# Altium schematic sheet MCU.SchDoc
size A4
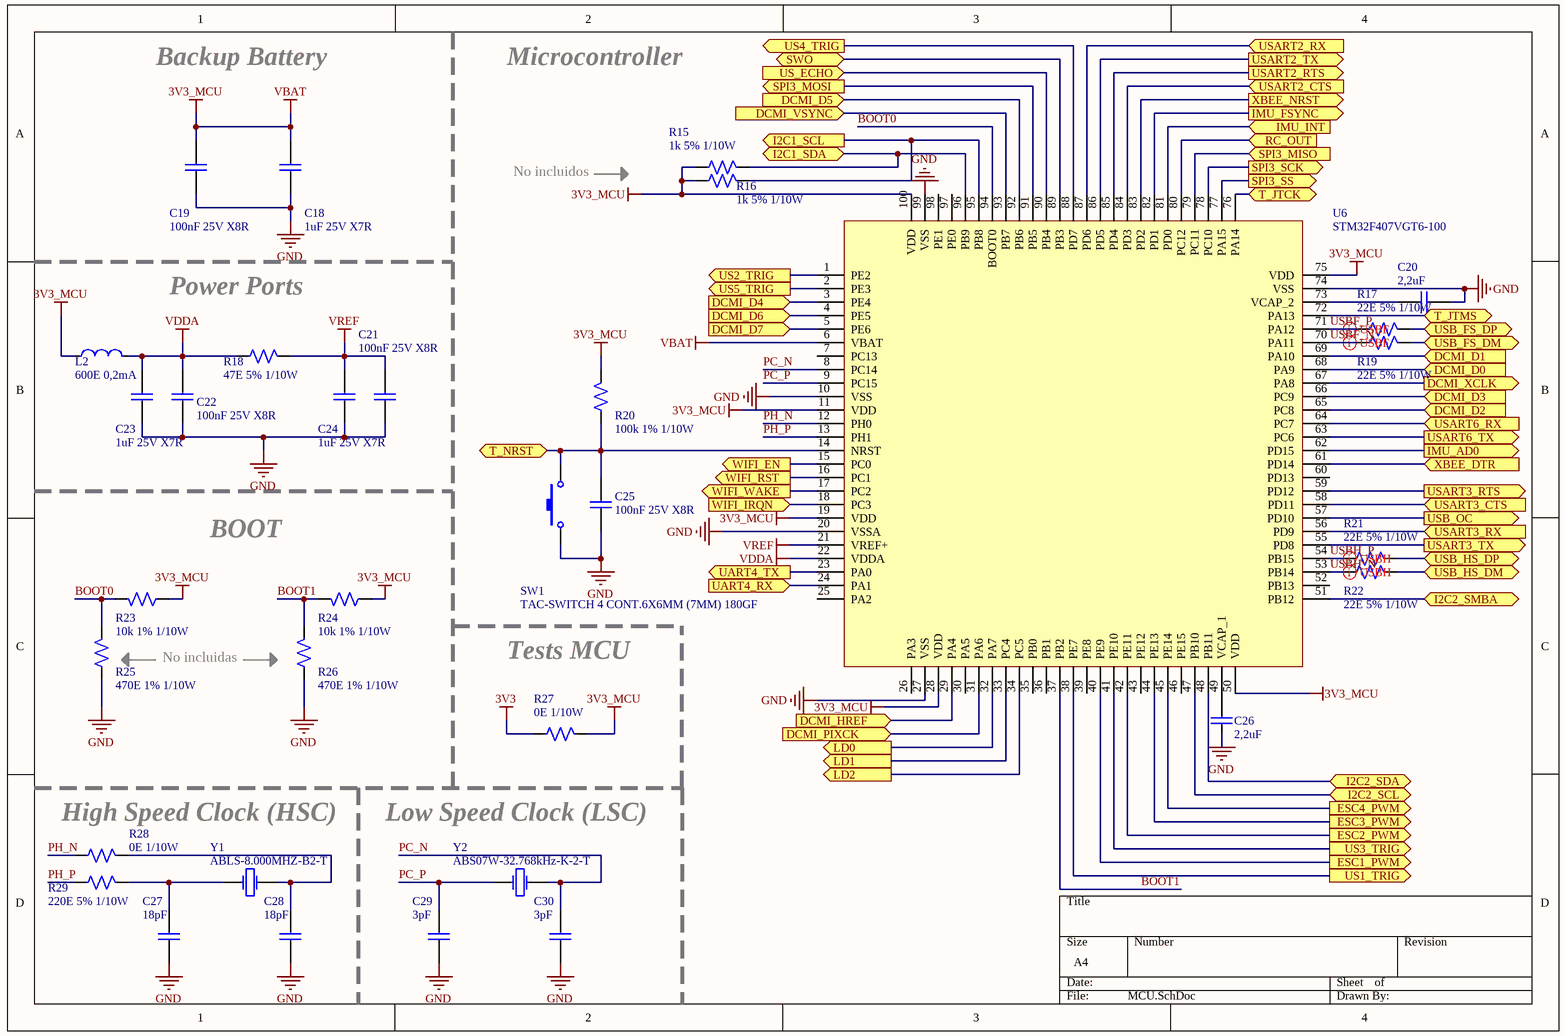
[diagram p0: MCU.SchDoc]

## Parts
C18  1uF 25V X7R  [C0603]
C19  100nF 25V X8R  [C0603]
C20  Valor: 2,2uF  [C0603]  (hidden comment: 2,2uF 16V X7R)
C21  100nF 25V X8R  [C0603]
C22  100nF 25V X8R  [C0603]
C23  1uF 25V X7R  [C0603]
C24  1uF 25V X7R  [C0603]
C25  100nF 25V X8R  [C0603]
C26  Valor: 2,2uF  [C0603]  (hidden comment: 2,2uF 16V X7R)
C27  Valor: 18pF  [C0603]  (hidden comment: 18pF 50V COG 5%)
C28  Valor: 18pF  [C0603]  (hidden comment: 18pF 50V COG 5%)
C29  Valor: 3pF  [C0603]  (hidden comment: 3pF 50V COG 5%)
C30  Valor: 3pF  [C0603]  (hidden comment: 3pF 50V COG 5%)
L2  600E 0,2mA  [L0805]
R15  1k 5% 1/10W  [R0603]
R16  1k 5% 1/10W  [R0603]
R17  22E 5% 1/10W  [R0603]
R18  47E 5% 1/10W  [R0603]
R19  22E 5% 1/10W  [R0603]
R20  100k 1% 1/10W  [R0603]
R21  22E 5% 1/10W  [R0603]
R22  22E 5% 1/10W  [R0603]
R23  10k 1% 1/10W  [R0603]
R24  10k 1% 1/10W  [R0603]
R25  470E 1% 1/10W  [R0603]
R26  470E 1% 1/10W  [R0603]
R27  0E 1/10W  [R0805]
R28  0E 1/10W  [R0603]
R29  220E 5% 1/10W  [R0603]
SW1  TAC-SWITCH 4 CONT.6X6MM (7MM) 180GF  [TAC_SW_4]
U6  STM32F407VGT6-100  [QFP100]
Y1  ABLS-8.000MHZ-B2-T  [ABLS]
Y2  ABS07W-32.768kHz-K-2-T  [ABS07W]

## Ports
DCMI_D0 (in), DCMI_D1 (in), DCMI_D2 (in), DCMI_D3 (in), DCMI_D4 (in), DCMI_D5 (in), DCMI_D6 (in), DCMI_D7 (in), DCMI_HREF (in), DCMI_PIXCK (in), DCMI_VSYNC (in), DCMI_XCLK (out), ESC1_PWM (out), ESC2_PWM (out), ESC3_PWM (out), ESC4_PWM (out), I2C1_SCL (out), I2C1_SDA (bidir), I2C2_SCL (bidir), I2C2_SDA (bidir), I2C2_SMBA (bidir), IMU_AD0 (out), IMU_FSYNC (out), IMU_INT (in), LD0 (out), LD1 (out), LD2 (out), RC_OUT (in), SPI3_MISO (in), SPI3_MOSI (out), SPI3_SCK (out), SPI3_SS (out), SWO, T_JTCK, T_JTMS, T_NRST, UART4_RX (in), UART4_TX (out), US1_TRIG (out), US2_TRIG (out), US3_TRIG (out), US4_TRIG (out), US5_TRIG (out), US_ECHO (in), USART2_CTS (in), USART2_RTS (out), USART2_RX (in), USART2_TX (out), USART3_CTS (in), USART3_RTS (out), USART3_RX (in), USART3_TX (out), USART6_RX (in), USART6_TX (out), USB_FS_DM (bidir), USB_FS_DP (bidir), USB_HS_DM (bidir), USB_HS_DP (bidir), USB_OC (out), WIFI_EN (out), WIFI_IRQN (in), WIFI_RST (out), WIFI_WAKE (out), XBEE_DTR (in), XBEE_NRST (out)

## Nets
3V3: R27.1
3V3_MCU: C18.1 C19.1 L2.1 R15.1 R16.1 R20.2 R23.1 R24.1 R27.2 U6.6(VBAT) U6.11(VDD) U6.19(VDD) U6.28(VDD) U6.50(VDD) U6.75(VDD) U6.100(VDD)  [also labelled VBAT]
GND: C18.2 C19.2 C20.2 C21.2 C22.2 C23.2 C24.2 C25.2 C26.2 C27.2 C28.2 C29.2 C30.2 R25.1 R26.1 SW1.1 U6.10(VSS) U6.20(VSSA) U6.27(VSS) U6.74(VSS) U6.99(VSS)
VDDA: C22.1 C23.1 L2.2 R18.1 U6.22(VDDA)
VREF: C21.1 C24.1 R18.2 U6.21(VREF+)
BOOT0: R23.2 R25.2 U6.94(BOOT0)
BOOT1: R24.2 R26.2 U6.37(PB2)
DCMI_D0: U6.68(PA9) ; port DCMI_D0
DCMI_D1: U6.69(PA10) ; port DCMI_D1
DCMI_D2: U6.65(PC8) ; port DCMI_D2
DCMI_D3: U6.66(PC9) ; port DCMI_D3
DCMI_D4: U6.3(PE4) ; port DCMI_D4
DCMI_D5: U6.92(PB6) ; port DCMI_D5
DCMI_D6: U6.4(PE5) ; port DCMI_D6
DCMI_D7: U6.5(PE6) ; port DCMI_D7
DCMI_HREF: U6.29(PA4) ; port DCMI_HREF
DCMI_PIXCK: U6.31(PA6) ; port DCMI_PIXCK
DCMI_VSYNC: U6.93(PB7) ; port DCMI_VSYNC
DCMI_XCLK: U6.67(PA8) ; port DCMI_XCLK
ESC1_PWM: U6.40(PE9) ; port ESC1_PWM
ESC2_PWM: U6.42(PE11) ; port ESC2_PWM
ESC3_PWM: U6.44(PE13) ; port ESC3_PWM
ESC4_PWM: U6.45(PE14) ; port ESC4_PWM
I2C1_SCL: R16.2 U6.95(PB8) ; port I2C1_SCL
I2C1_SDA: R15.2 U6.96(PB9) ; port I2C1_SDA
I2C2_SCL: U6.47(PB10) ; port I2C2_SCL
I2C2_SDA: U6.48(PB11) ; port I2C2_SDA
I2C2_SMBA: U6.51(PB12) ; port I2C2_SMBA
IMU_AD0: U6.62(PD15) ; port IMU_AD0
IMU_FSYNC: U6.82(PD1) ; port IMU_FSYNC
IMU_INT: U6.81(PD0) ; port IMU_INT
LD0: U6.32(PA7) ; port LD0
LD1: U6.33(PC4) ; port LD1
LD2: U6.34(PC5) ; port LD2
PC_N: C30.1 U6.8(PC14) Y2.2
PC_P: C29.1 U6.9(PC15) Y2.1
PH_N: R28.1 U6.12(PH0)
PH_P: R29.1 U6.13(PH1)
RC_OUT: U6.80(PC12) ; port RC_OUT
SPI3_MISO: U6.79(PC11) ; port SPI3_MISO
SPI3_MOSI: U6.91(PB5) ; port SPI3_MOSI
SPI3_SCK: U6.78(PC10) ; port SPI3_SCK
SPI3_SS: U6.77(PA15) ; port SPI3_SS
SWO: U6.89(PB3) ; port SWO
T_JTCK: U6.76(PA14) ; port T_JTCK
T_JTMS: U6.72(PA13) ; port T_JTMS
T_NRST: C25.1 R20.1 SW1.2 U6.14(NRST) ; port T_NRST
UART4_RX: U6.24(PA1) ; port UART4_RX
UART4_TX: U6.23(PA0) ; port UART4_TX
US1_TRIG: U6.38(PE7) ; port US1_TRIG
US2_TRIG: U6.1(PE2) ; port US2_TRIG
US3_TRIG: U6.41(PE10) ; port US3_TRIG
US4_TRIG: U6.88(PD7) ; port US4_TRIG
US5_TRIG: U6.2(PE3) ; port US5_TRIG
US_ECHO: U6.90(PB4) ; port US_ECHO
USART2_CTS: U6.84(PD3) ; port USART2_CTS
USART2_RTS: U6.85(PD4) ; port USART2_RTS
USART2_RX: U6.87(PD6) ; port USART2_RX
USART2_TX: U6.86(PD5) ; port USART2_TX
USART3_CTS: U6.58(PD11) ; port USART3_CTS
USART3_RTS: U6.59(PD12) ; port USART3_RTS
USART3_RX: U6.56(PD9) ; port USART3_RX
USART3_TX: U6.55(PD8) ; port USART3_TX
USART6_RX: U6.64(PC7) ; port USART6_RX
USART6_TX: U6.63(PC6) ; port USART6_TX
USB_FS_DM: R19.2 ; port USB_FS_DM
USB_FS_DP: R17.2 ; port USB_FS_DP
USB_HS_DM: R22.2 ; port USB_HS_DM
USB_HS_DP: R21.2 ; port USB_HS_DP
USB_OC: U6.57(PD10) ; port USB_OC
USBF_N: R19.1 U6.70(PA11)
USBF_P: R17.1 U6.71(PA12)
USBH_N: R22.1 U6.53(PB14)
USBH_P: R21.1 U6.54(PB15)
WIFI_EN: U6.15(PC0) ; port WIFI_EN
WIFI_IRQN: U6.18(PC3) ; port WIFI_IRQN
WIFI_RST: U6.16(PC1) ; port WIFI_RST
WIFI_WAKE: U6.17(PC2) ; port WIFI_WAKE
XBEE_DTR: U6.61(PD14) ; port XBEE_DTR
XBEE_NRST: U6.83(PD2) ; port XBEE_NRST
NetC20_1: C20.1 U6.73(VCAP_2)
NetC26_1: C26.1 U6.49(VCAP_1)
NetC27_1: C27.1 R29.2 Y1.1
NetC28_1: C28.1 R28.2 Y1.2

Not connected (* = marked no-connect by the designer): U6 7(PC13) 25(PA2) 26(PA3) 30(PA5) 35(PB0) 36(PB1) 39(PE8) 43(PE12) 46(PE15) 52(PB13) 60(PD13) 97(PE0) 98(PE1)

## Layout directives
differential pair: USBF_N, USBF_P, USBH_N, USBH_P

## Notes on the sheet
- Backup Battery
- Microcontroller
- No incluidos
- Power Ports
- BOOT
- No incluidas
- Tests MCU
- (near R28) High Speed Clock (HSC)
- Low Speed Clock (LSC)

## Library data of the parts
C18 C23 C24 = Capacitor: Capacitor de placas paralelas; Proveedor: Mouser; Cod. Proveedor: 810-C1608X7R1E105KAE; Encapsulado: C0603; Valor: 1uF; Link: https://ar.mouser.com
C19 C21 C22 C25 = Capacitor: Capacitor de placas paralelas; Proveedor: Mouser; Cod. Proveedor: 810-C1608X8R1E104K; Encapsulado: C0603; Valor: 100nF; Link: https://ar.mouser.com
C20 C26 = Capacitor: Capacitor de placas paralelas; Proveedor: Mouser; Cod. Proveedor: 80-C0805C225K4R3123; Encapsulado: C0603; Link: https://ar.mouser.com/
C27-C30 = Capacitor: Capacitor de placas paralelas; Proveedor: Elemon; Cod. Proveedor: CA3278360; Encapsulado: C0603; Link: http://www.elemon.net/
L2 = Inductor: Cod. Proveedor: FI1488955; Proveedor: Elemon; Encapsulado: L0805; Valor: 600E 0,2mA; Link: http://www.elemon.net/
R15 R16 = Resistor: Resistencia; Cod. Proveedor: 603-AF0603JR-071KL; Proveedor: Mouser; Encapsulado: R0603; Valor: 1k; Link: https://ar.mouser.com
R17 R19 R21 R22 = Resistor: Resistencia; Cod. Proveedor: 71-CRCW060322R0JNEAC; Proveedor: Mouser; Encapsulado: R0603; Valor: 22E; Link: https://ar.mouser.com
R18 = Resistor: Resistencia; Cod. Proveedor: 667-ERJ-3GEYJ470V; Proveedor: Mouser; Encapsulado: R0603; Valor: 47E; Link: https://ar.mouser.com
R20 = Resistor: Resistencia; Cod. Proveedor: 71-CRCW0603100KFKEAC; Proveedor: Mouser; Encapsulado: R0603; Valor: 100k; Link: https://ar.mouser.com
R23 R24 = Resistor: Resistencia; Cod. Proveedor: 71-CRCW060310K0FKEAC; Proveedor: Mouser; Encapsulado: R0603; Valor: 10k; Link: https://ar.mouser.com
R25 R26 = Resistor: Resistencia; Cod. Proveedor: 603-RC0603FR-10470RL; Proveedor: Mouser; Encapsulado: R0603; Valor: 470E; Link: https://ar.mouser.com
R27 = Resistor: Resistencia; Cod. Proveedor: RS3895900; Proveedor: Mouser; Encapsulado: MODIFICAR; Valor: 0E; Link: https://ar.mouser.com
R28 = Resistor: Resistencia; Cod. Proveedor: RS3895900; Proveedor: Mouser; Encapsulado: R0603; Valor: 0E; Link: https://ar.mouser.com
R29 = Resistor: Resistencia; Cod. Proveedor: 71-CRCW0603220RJNEAC; Proveedor: Mouser; Encapsulado: R0603; Valor: 220E; Link: https://ar.mouser.com
SW1 = TAC_SWITCH_4: Pulsador de 4 pines; Proveedor: Elemon; Cod. Proveedor: MC5702109; Encapsulado: Through Hole; Link: http://www.elemon.net
U6 = STM32F407VGT6_100: Microcontrolador STM32F407VGT6 100 pines; Cod. Proveedor: 511-STM32F407VGT6; Proveedor: Mouser; Encapsulado: QFP100; Link: https://ar.mouser.com/
Y1 = XTAL: Resonador cerámico; Cod. Proveedor: 815-ABLS-8-B2; Proveedor: Mouser; Encapsulado: SMD; Link: https://ar.mouser.com
Y2 = XTAL: Resonador cerámico; Cod. Proveedor: 815-ABS07W32.768KK2T; Proveedor: Mouser; Encapsulado: SMD; Link: https://ar.mouser.com